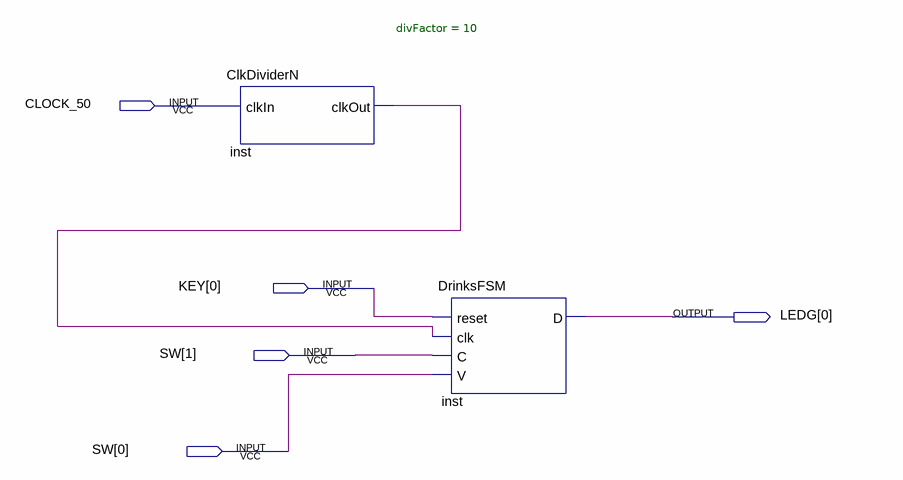
[diagram p0: schematic sheet]
// Quartus schematic DrinksMachine.bdf as structural Verilog: 2 symbols, 5 pins
module DrinksMachine (
  input  CLOCK_50,
  input  [0:0] KEY,
  input  [1:0] SW,
  output [0:0] LEDG
);

  wire inst_clkout;

  ClkDividerN #(.divFactor(10)) inst (.clkIn(CLOCK_50), .clkOut(inst_clkout));
  DrinksFSM inst_dup2 (.reset(KEY[0]), .clk(inst_clkout), .C(SW[1]), .V(SW[0]), .D(LEDG[0]));
endmodule
